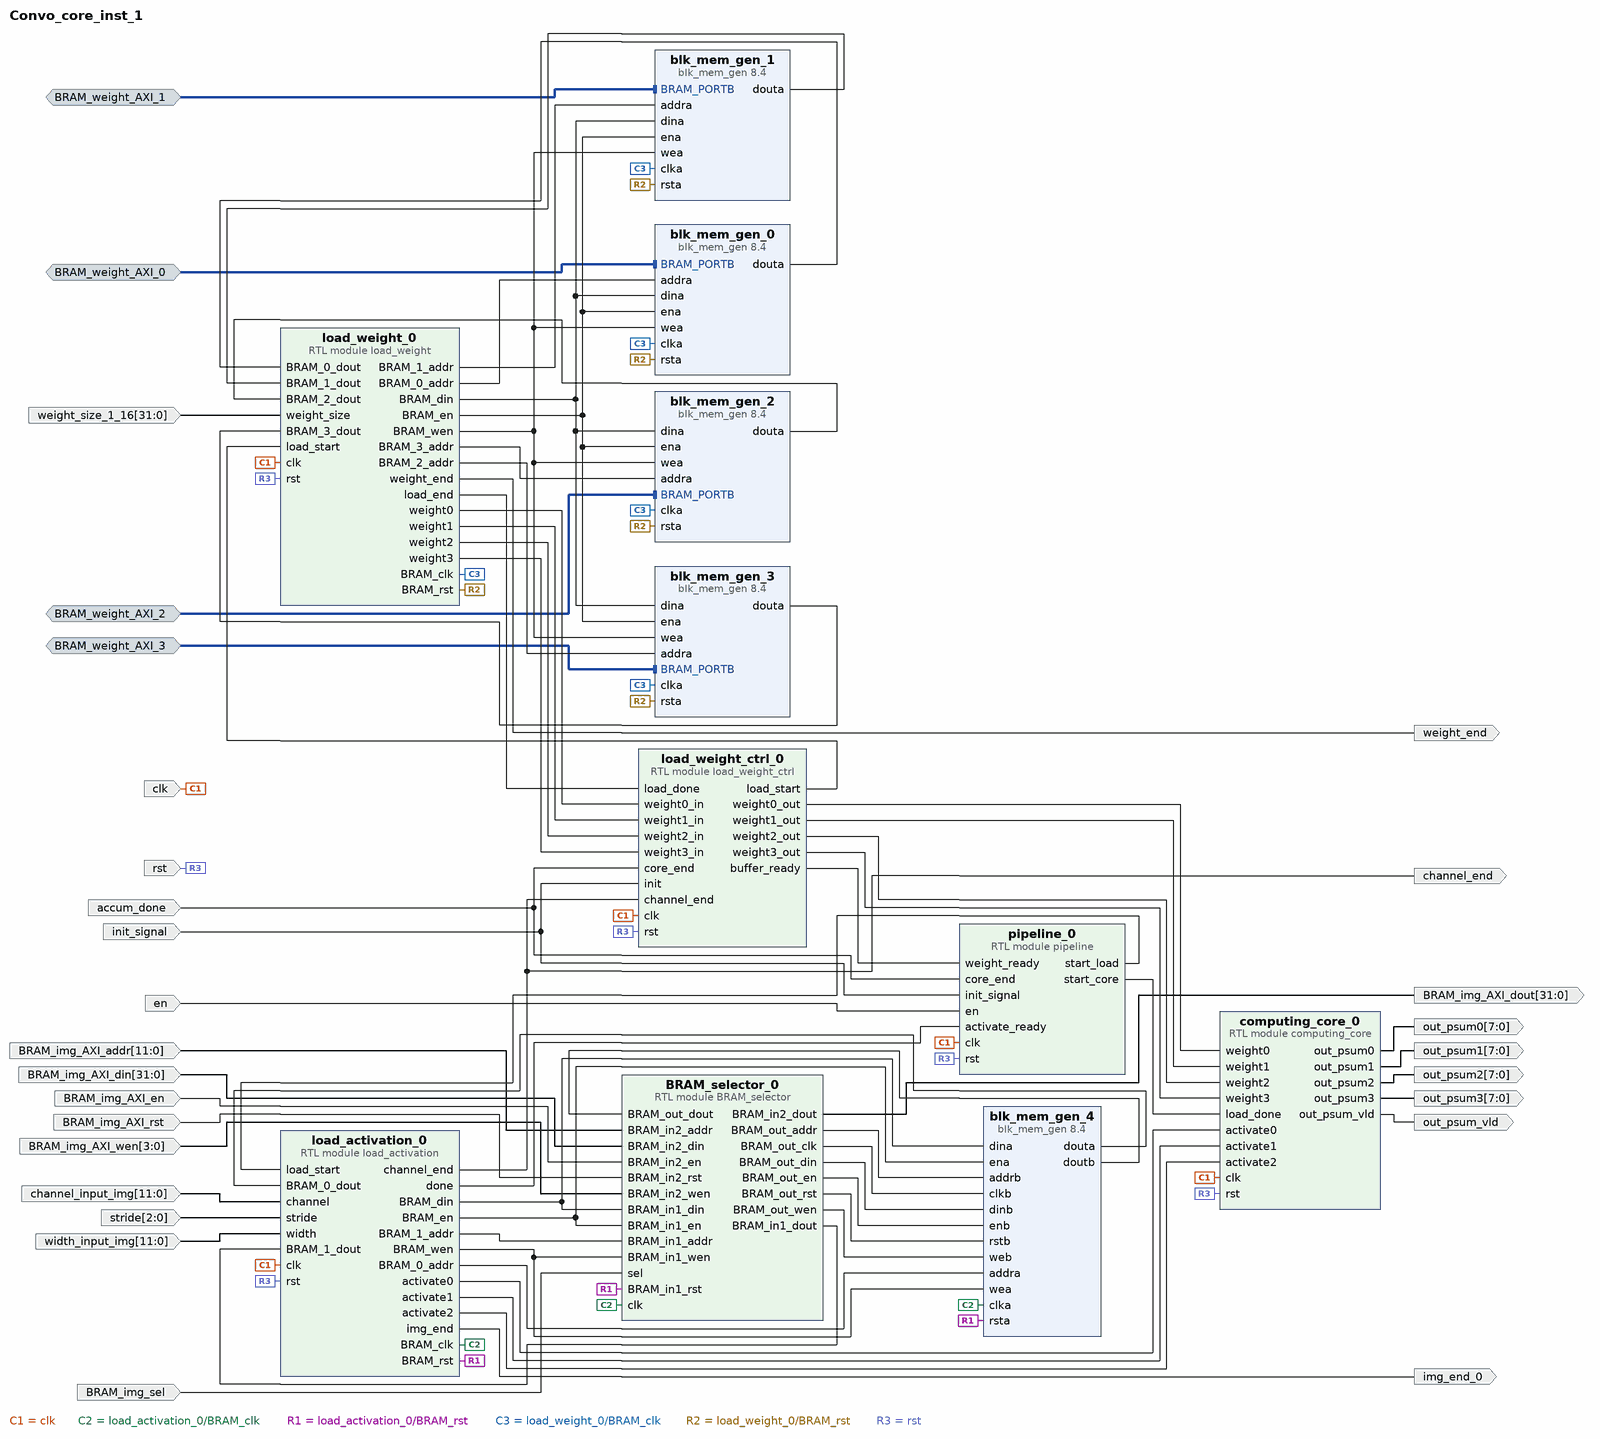
[diagram p0: block diagram of the top level]
# Vivado block design Convo_core_inst_1, xc7z020clg400-1, Vivado 2021.1
create_bd_design Convo_core_inst_1

create_bd_intf_port -mode Slave -vlnv xilinx.com:interface:bram_rtl:1.0 BRAM_weight_AXI_1
create_bd_intf_port -mode Slave -vlnv xilinx.com:interface:bram_rtl:1.0 BRAM_weight_AXI_0
create_bd_intf_port -mode Slave -vlnv xilinx.com:interface:bram_rtl:1.0 BRAM_weight_AXI_2
create_bd_intf_port -mode Slave -vlnv xilinx.com:interface:bram_rtl:1.0 BRAM_weight_AXI_3
create_bd_port -dir I -type clk clk
create_bd_port -dir I -type rst rst
create_bd_port -dir O -from 7 -to 0 out_psum0
create_bd_port -dir O -from 7 -to 0 out_psum1
create_bd_port -dir O -from 7 -to 0 out_psum2
create_bd_port -dir O -from 7 -to 0 out_psum3
create_bd_port -dir O out_psum_vld
create_bd_port -dir I -from 2 -to 0 stride
create_bd_port -dir I -from 11 -to 0 width_input_img
create_bd_port -dir I -from 11 -to 0 channel_input_img
create_bd_port -dir I init_signal
create_bd_port -dir I en
create_bd_port -dir I -from 31 -to 0 weight_size_1_16
create_bd_port -dir O weight_end
create_bd_port -dir I accum_done
create_bd_port -dir I BRAM_img_sel
create_bd_port -dir I -from 11 -to 0 BRAM_img_AXI_addr
create_bd_port -dir I -from 31 -to 0 BRAM_img_AXI_din
create_bd_port -dir O -from 31 -to 0 BRAM_img_AXI_dout
create_bd_port -dir I BRAM_img_AXI_en
create_bd_port -dir I -type rst BRAM_img_AXI_rst
create_bd_port -dir I -from 3 -to 0 BRAM_img_AXI_wen
create_bd_port -dir O channel_end
create_bd_port -dir O img_end_0

create_bd_cell -type ip -vlnv xilinx.com:ip:blk_mem_gen:8.4 blk_mem_gen_0
set_property -dict [list \
  CONFIG.Assume_Synchronous_Clk true \
  CONFIG.Coe_File ../../../../../../program/bram_weight_init/bram_weight_init_0.coe \
  CONFIG.EN_SAFETY_CKT false \
  CONFIG.Enable_32bit_Address true \
  CONFIG.Enable_B Use_ENB_Pin \
  CONFIG.Fill_Remaining_Memory_Locations false \
  CONFIG.Load_Init_File true \
  CONFIG.Memory_Type True_Dual_Port_RAM \
  CONFIG.Port_B_Clock 100 \
  CONFIG.Port_B_Enable_Rate 100 \
  CONFIG.Port_B_Write_Rate 50 \
  CONFIG.Register_PortA_Output_of_Memory_Primitives false \
  CONFIG.Register_PortB_Output_of_Memory_Primitives false \
  CONFIG.Use_RSTA_Pin true \
  CONFIG.Use_RSTB_Pin true \
  CONFIG.use_bram_block Stand_Alone \
] [get_bd_cells blk_mem_gen_0]
create_bd_cell -type ip -vlnv xilinx.com:ip:blk_mem_gen:8.4 blk_mem_gen_1
set_property -dict [list \
  CONFIG.Assume_Synchronous_Clk true \
  CONFIG.Coe_File ../../../../../../program/bram_weight_init/bram_weight_init_1.coe \
  CONFIG.EN_SAFETY_CKT false \
  CONFIG.Enable_32bit_Address true \
  CONFIG.Enable_B Use_ENB_Pin \
  CONFIG.Load_Init_File true \
  CONFIG.Memory_Type True_Dual_Port_RAM \
  CONFIG.Port_B_Clock 100 \
  CONFIG.Port_B_Enable_Rate 100 \
  CONFIG.Port_B_Write_Rate 50 \
  CONFIG.Register_PortA_Output_of_Memory_Primitives false \
  CONFIG.Register_PortB_Output_of_Memory_Primitives false \
  CONFIG.Use_RSTA_Pin true \
  CONFIG.Use_RSTB_Pin true \
  CONFIG.use_bram_block Stand_Alone \
] [get_bd_cells blk_mem_gen_1]
create_bd_cell -type ip -vlnv xilinx.com:ip:blk_mem_gen:8.4 blk_mem_gen_2
set_property -dict [list \
  CONFIG.Assume_Synchronous_Clk true \
  CONFIG.Coe_File ../../../../../../program/bram_weight_init/bram_weight_init_2.coe \
  CONFIG.EN_SAFETY_CKT false \
  CONFIG.Enable_32bit_Address true \
  CONFIG.Enable_B Use_ENB_Pin \
  CONFIG.Load_Init_File true \
  CONFIG.Memory_Type True_Dual_Port_RAM \
  CONFIG.Port_B_Clock 100 \
  CONFIG.Port_B_Enable_Rate 100 \
  CONFIG.Port_B_Write_Rate 50 \
  CONFIG.Register_PortA_Output_of_Memory_Primitives false \
  CONFIG.Register_PortB_Output_of_Memory_Primitives false \
  CONFIG.Use_RSTA_Pin true \
  CONFIG.Use_RSTB_Pin true \
  CONFIG.use_bram_block Stand_Alone \
] [get_bd_cells blk_mem_gen_2]
create_bd_cell -type ip -vlnv xilinx.com:ip:blk_mem_gen:8.4 blk_mem_gen_3
set_property -dict [list \
  CONFIG.Assume_Synchronous_Clk true \
  CONFIG.Coe_File ../../../../../../program/bram_weight_init/bram_weight_init_3.coe \
  CONFIG.EN_SAFETY_CKT false \
  CONFIG.Enable_32bit_Address true \
  CONFIG.Enable_B Use_ENB_Pin \
  CONFIG.Load_Init_File true \
  CONFIG.Memory_Type True_Dual_Port_RAM \
  CONFIG.Port_B_Clock 100 \
  CONFIG.Port_B_Enable_Rate 100 \
  CONFIG.Port_B_Write_Rate 50 \
  CONFIG.Register_PortA_Output_of_Memory_Primitives false \
  CONFIG.Register_PortB_Output_of_Memory_Primitives false \
  CONFIG.Use_RSTA_Pin true \
  CONFIG.Use_RSTB_Pin true \
  CONFIG.use_bram_block Stand_Alone \
] [get_bd_cells blk_mem_gen_3]
create_bd_cell -type ip -vlnv xilinx.com:ip:blk_mem_gen:8.4 blk_mem_gen_4
set_property -dict [list \
  CONFIG.Assume_Synchronous_Clk true \
  CONFIG.Coe_File ../../../../../../program/bram_input_init/bram_input_init_0.coe \
  CONFIG.EN_SAFETY_CKT false \
  CONFIG.Enable_32bit_Address true \
  CONFIG.Enable_B Use_ENB_Pin \
  CONFIG.Load_Init_File true \
  CONFIG.Memory_Type True_Dual_Port_RAM \
  CONFIG.Port_B_Clock 100 \
  CONFIG.Port_B_Enable_Rate 100 \
  CONFIG.Port_B_Write_Rate 50 \
  CONFIG.Register_PortA_Output_of_Memory_Primitives false \
  CONFIG.Register_PortB_Output_of_Memory_Primitives false \
  CONFIG.Use_RSTA_Pin true \
  CONFIG.Use_RSTB_Pin true \
  CONFIG.use_bram_block Stand_Alone \
] [get_bd_cells blk_mem_gen_4]
create_bd_cell -type module -reference load_weight load_weight_0
create_bd_cell -type module -reference BRAM_selector BRAM_selector_0
create_bd_cell -type module -reference load_weight_ctrl load_weight_ctrl_0
create_bd_cell -type module -reference pipeline pipeline_0
create_bd_cell -type module -reference computing_core computing_core_0
create_bd_cell -type module -reference load_activation load_activation_0

# ---- connections ----

connect_bd_intf_net -intf_net BRAM_PORTB_0_1 [get_bd_intf_ports BRAM_weight_AXI_1] [get_bd_intf_pins blk_mem_gen_1/BRAM_PORTB]
connect_bd_intf_net -intf_net BRAM_PORTB_1_1 [get_bd_intf_ports BRAM_weight_AXI_0] [get_bd_intf_pins blk_mem_gen_0/BRAM_PORTB]
connect_bd_intf_net -intf_net BRAM_PORTB_2_1 [get_bd_intf_ports BRAM_weight_AXI_2] [get_bd_intf_pins blk_mem_gen_2/BRAM_PORTB]
connect_bd_intf_net -intf_net BRAM_PORTB_3_1 [get_bd_intf_ports BRAM_weight_AXI_3] [get_bd_intf_pins blk_mem_gen_3/BRAM_PORTB]
connect_bd_net -net BRAM_in2_addr_0_1 [get_bd_ports BRAM_img_AXI_addr] [get_bd_pins BRAM_selector_0/BRAM_in2_addr]
connect_bd_net -net BRAM_in2_din_0_1 [get_bd_ports BRAM_img_AXI_din] [get_bd_pins BRAM_selector_0/BRAM_in2_din]
connect_bd_net -net BRAM_in2_en_0_1 [get_bd_ports BRAM_img_AXI_en] [get_bd_pins BRAM_selector_0/BRAM_in2_en]
connect_bd_net -net BRAM_in2_rst_0_1 [get_bd_ports BRAM_img_AXI_rst] [get_bd_pins BRAM_selector_0/BRAM_in2_rst]
connect_bd_net -net BRAM_in2_wen_0_1 [get_bd_ports BRAM_img_AXI_wen] [get_bd_pins BRAM_selector_0/BRAM_in2_wen]
connect_bd_net [get_bd_pins BRAM_selector_0/BRAM_in1_dout] [get_bd_pins load_activation_0/BRAM_1_dout]
connect_bd_net [get_bd_pins BRAM_selector_0/BRAM_in2_dout] [get_bd_ports BRAM_img_AXI_dout]
connect_bd_net [get_bd_pins BRAM_selector_0/BRAM_out_addr] [get_bd_pins blk_mem_gen_4/addrb]
connect_bd_net [get_bd_pins BRAM_selector_0/BRAM_out_clk] [get_bd_pins blk_mem_gen_4/clkb]
connect_bd_net [get_bd_pins BRAM_selector_0/BRAM_out_din] [get_bd_pins blk_mem_gen_4/dinb]
connect_bd_net [get_bd_pins BRAM_selector_0/BRAM_out_en] [get_bd_pins blk_mem_gen_4/enb]
connect_bd_net [get_bd_pins BRAM_selector_0/BRAM_out_rst] [get_bd_pins blk_mem_gen_4/rstb]
connect_bd_net [get_bd_pins BRAM_selector_0/BRAM_out_wen] [get_bd_pins blk_mem_gen_4/web]
connect_bd_net [get_bd_ports accum_done] [get_bd_pins load_weight_ctrl_0/core_end] [get_bd_pins pipeline_0/core_end]
connect_bd_net [get_bd_pins blk_mem_gen_0/douta] [get_bd_pins load_weight_0/BRAM_0_dout]
connect_bd_net [get_bd_pins blk_mem_gen_1/douta] [get_bd_pins load_weight_0/BRAM_1_dout]
connect_bd_net [get_bd_pins blk_mem_gen_2/douta] [get_bd_pins load_weight_0/BRAM_2_dout]
connect_bd_net [get_bd_pins blk_mem_gen_3/douta] [get_bd_pins load_weight_0/BRAM_3_dout]
connect_bd_net [get_bd_pins blk_mem_gen_4/douta] [get_bd_pins load_activation_0/BRAM_0_dout]
connect_bd_net [get_bd_pins blk_mem_gen_4/doutb] [get_bd_pins BRAM_selector_0/BRAM_out_dout]
connect_bd_net -net channel_0_1 [get_bd_ports channel_input_img] [get_bd_pins load_activation_0/channel]
connect_bd_net -net clk_0_1 [get_bd_ports clk] \
  [get_bd_pins load_weight_0/clk] [get_bd_pins load_weight_ctrl_0/clk] [get_bd_pins pipeline_0/clk] \
  [get_bd_pins computing_core_0/clk] [get_bd_pins load_activation_0/clk]
connect_bd_net [get_bd_pins computing_core_0/out_psum0] [get_bd_ports out_psum0]
connect_bd_net [get_bd_pins computing_core_0/out_psum1] [get_bd_ports out_psum1]
connect_bd_net [get_bd_pins computing_core_0/out_psum2] [get_bd_ports out_psum2]
connect_bd_net [get_bd_pins computing_core_0/out_psum3] [get_bd_ports out_psum3]
connect_bd_net [get_bd_pins computing_core_0/out_psum_vld] [get_bd_ports out_psum_vld]
connect_bd_net -net en_0_1 [get_bd_ports en] [get_bd_pins pipeline_0/en]
connect_bd_net -net init_signal_0_1 [get_bd_ports init_signal] [get_bd_pins load_weight_ctrl_0/init] [get_bd_pins pipeline_0/init_signal]
connect_bd_net [get_bd_pins load_activation_0/BRAM_0_addr] [get_bd_pins blk_mem_gen_4/addra]
connect_bd_net [get_bd_pins load_activation_0/BRAM_1_addr] [get_bd_pins BRAM_selector_0/BRAM_in1_addr]
connect_bd_net [get_bd_pins load_activation_0/BRAM_clk] [get_bd_pins blk_mem_gen_4/clka] [get_bd_pins BRAM_selector_0/clk]
connect_bd_net [get_bd_pins load_activation_0/BRAM_din] [get_bd_pins blk_mem_gen_4/dina] [get_bd_pins BRAM_selector_0/BRAM_in1_din]
connect_bd_net [get_bd_pins load_activation_0/BRAM_en] [get_bd_pins blk_mem_gen_4/ena] [get_bd_pins BRAM_selector_0/BRAM_in1_en]
connect_bd_net [get_bd_pins load_activation_0/BRAM_rst] [get_bd_pins blk_mem_gen_4/rsta] [get_bd_pins BRAM_selector_0/BRAM_in1_rst]
connect_bd_net [get_bd_pins load_activation_0/BRAM_wen] [get_bd_pins blk_mem_gen_4/wea] [get_bd_pins BRAM_selector_0/BRAM_in1_wen]
connect_bd_net [get_bd_pins load_activation_0/activate0] [get_bd_pins computing_core_0/activate0]
connect_bd_net [get_bd_pins load_activation_0/activate1] [get_bd_pins computing_core_0/activate1]
connect_bd_net [get_bd_pins load_activation_0/activate2] [get_bd_pins computing_core_0/activate2]
connect_bd_net [get_bd_pins load_activation_0/channel_end] [get_bd_ports channel_end] [get_bd_pins load_weight_ctrl_0/channel_end]
connect_bd_net [get_bd_pins load_activation_0/done] [get_bd_pins pipeline_0/activate_ready]
connect_bd_net [get_bd_pins load_activation_0/img_end] [get_bd_ports img_end_0]
connect_bd_net [get_bd_pins load_weight_0/BRAM_0_addr] [get_bd_pins blk_mem_gen_0/addra]
connect_bd_net [get_bd_pins load_weight_0/BRAM_1_addr] [get_bd_pins blk_mem_gen_1/addra]
connect_bd_net [get_bd_pins load_weight_0/BRAM_2_addr] [get_bd_pins blk_mem_gen_3/addra]
connect_bd_net [get_bd_pins load_weight_0/BRAM_3_addr] [get_bd_pins blk_mem_gen_2/addra]
connect_bd_net [get_bd_pins load_weight_0/BRAM_clk] \
  [get_bd_pins blk_mem_gen_0/clka] [get_bd_pins blk_mem_gen_1/clka] [get_bd_pins blk_mem_gen_3/clka] \
  [get_bd_pins blk_mem_gen_2/clka]
connect_bd_net [get_bd_pins load_weight_0/BRAM_din] \
  [get_bd_pins blk_mem_gen_0/dina] [get_bd_pins blk_mem_gen_1/dina] [get_bd_pins blk_mem_gen_3/dina] \
  [get_bd_pins blk_mem_gen_2/dina]
connect_bd_net [get_bd_pins load_weight_0/BRAM_en] \
  [get_bd_pins blk_mem_gen_0/ena] [get_bd_pins blk_mem_gen_1/ena] [get_bd_pins blk_mem_gen_3/ena] \
  [get_bd_pins blk_mem_gen_2/ena]
connect_bd_net [get_bd_pins load_weight_0/BRAM_rst] \
  [get_bd_pins blk_mem_gen_0/rsta] [get_bd_pins blk_mem_gen_1/rsta] [get_bd_pins blk_mem_gen_3/rsta] \
  [get_bd_pins blk_mem_gen_2/rsta]
connect_bd_net [get_bd_pins load_weight_0/BRAM_wen] \
  [get_bd_pins blk_mem_gen_1/wea] [get_bd_pins blk_mem_gen_0/wea] [get_bd_pins blk_mem_gen_3/wea] \
  [get_bd_pins blk_mem_gen_2/wea]
connect_bd_net [get_bd_pins load_weight_0/load_end] [get_bd_pins load_weight_ctrl_0/load_done]
connect_bd_net [get_bd_pins load_weight_0/weight0] [get_bd_pins load_weight_ctrl_0/weight0_in]
connect_bd_net [get_bd_pins load_weight_0/weight1] [get_bd_pins load_weight_ctrl_0/weight1_in]
connect_bd_net [get_bd_pins load_weight_0/weight2] [get_bd_pins load_weight_ctrl_0/weight2_in]
connect_bd_net [get_bd_pins load_weight_0/weight3] [get_bd_pins load_weight_ctrl_0/weight3_in]
connect_bd_net [get_bd_pins load_weight_0/weight_end] [get_bd_ports weight_end]
connect_bd_net [get_bd_pins load_weight_ctrl_0/buffer_ready] [get_bd_pins pipeline_0/weight_ready]
connect_bd_net [get_bd_pins load_weight_ctrl_0/load_start] [get_bd_pins load_weight_0/load_start]
connect_bd_net [get_bd_pins load_weight_ctrl_0/weight0_out] [get_bd_pins computing_core_0/weight0]
connect_bd_net [get_bd_pins load_weight_ctrl_0/weight1_out] [get_bd_pins computing_core_0/weight1]
connect_bd_net [get_bd_pins load_weight_ctrl_0/weight2_out] [get_bd_pins computing_core_0/weight2]
connect_bd_net [get_bd_pins load_weight_ctrl_0/weight3_out] [get_bd_pins computing_core_0/weight3]
connect_bd_net [get_bd_pins pipeline_0/start_core] [get_bd_pins computing_core_0/load_done]
connect_bd_net [get_bd_pins pipeline_0/start_load] [get_bd_pins load_activation_0/load_start]
connect_bd_net -net rst_0_1 [get_bd_ports rst] \
  [get_bd_pins load_weight_0/rst] [get_bd_pins load_weight_ctrl_0/rst] [get_bd_pins pipeline_0/rst] \
  [get_bd_pins computing_core_0/rst] [get_bd_pins load_activation_0/rst]
connect_bd_net -net sel_0_1 [get_bd_ports BRAM_img_sel] [get_bd_pins BRAM_selector_0/sel]
connect_bd_net -net stride_0_1 [get_bd_ports stride] [get_bd_pins load_activation_0/stride]
connect_bd_net -net weight_size_0_1 [get_bd_ports weight_size_1_16] [get_bd_pins load_weight_0/weight_size]
connect_bd_net -net width_0_1 [get_bd_ports width_input_img] [get_bd_pins load_activation_0/width]

validate_bd_design
save_bd_design
